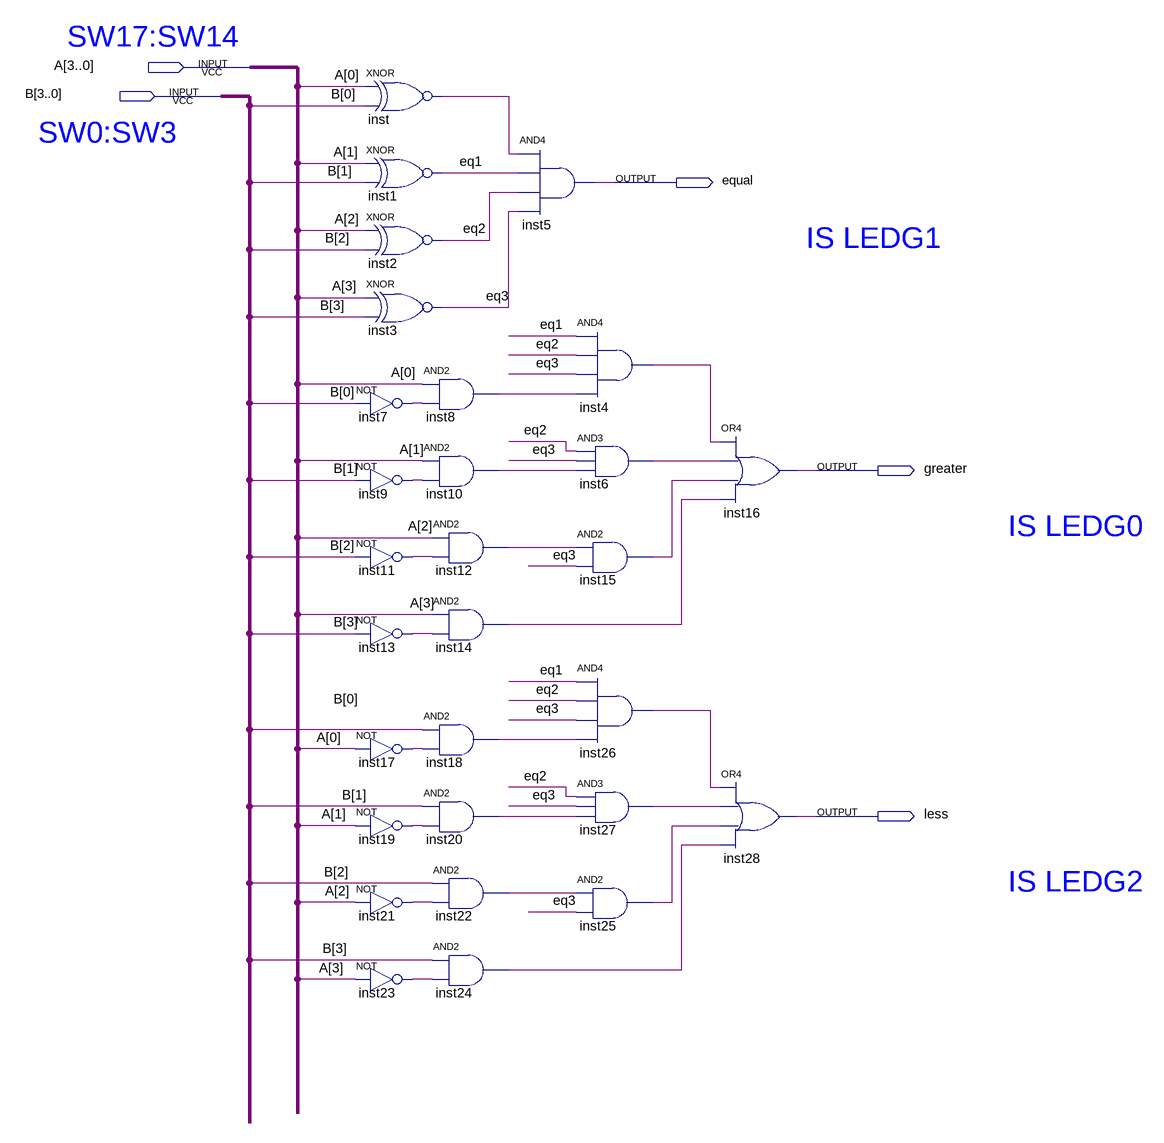
[diagram p0: schematic sheet]
// Quartus schematic Lab1_LogicalComparators.bdf as structural Verilog: 29 symbols, 5 pins
module Lab1_LogicalComparators (
  input  [3:0] A,
  input  [3:0] B,
  output equal,
  output greater,
  output less
);

  wire eq1, eq2, eq3, inst4_out, inst6_out, inst7_out, inst8_out, inst9_out, inst10_out, inst11_out,
       inst12_out, inst13_out, inst14_out, inst15_out, inst17_out, inst18_out, inst19_out, inst20_out,
       inst21_out, inst22_out, inst23_out, inst24_out, inst25_out, inst26_out, inst27_out, inst_out;

  not inst7 (inst7_out, B[0]);
  not inst9 (inst9_out, B[1]);
  not inst11 (inst11_out, B[2]);
  not inst13 (inst13_out, B[3]);
  not inst17 (inst17_out, A[0]);
  not inst19 (inst19_out, A[1]);
  not inst21 (inst21_out, A[2]);
  not inst23 (inst23_out, A[3]);
  xnor inst (inst_out, A[0], B[0]);
  xnor inst1 (eq1, A[1], B[1]);
  xnor inst2 (eq2, A[2], B[2]);
  xnor inst3 (eq3, A[3], B[3]);
  and inst8 (inst8_out, A[0], inst7_out);
  and inst10 (inst10_out, A[1], inst9_out);
  and inst12 (inst12_out, A[2], inst11_out);
  and inst14 (inst14_out, A[3], inst13_out);
  and inst18 (inst18_out, B[0], inst17_out);
  and inst20 (inst20_out, B[1], inst19_out);
  and inst22 (inst22_out, B[2], inst21_out);
  and inst24 (inst24_out, B[3], inst23_out);
  and inst5 (equal, inst_out, eq1, eq2, eq3);
  and inst4 (inst4_out, eq1, eq2, eq3, inst8_out);
  and inst6 (inst6_out, eq2, eq3, inst10_out);
  and inst15 (inst15_out, inst12_out, eq3);
  and inst26 (inst26_out, eq1, eq2, eq3, inst18_out);
  and inst27 (inst27_out, eq2, eq3, inst20_out);
  and inst25 (inst25_out, inst22_out, eq3);
  or inst16 (greater, inst4_out, inst6_out, inst15_out, inst14_out);
  or inst28 (less, inst26_out, inst27_out, inst25_out, inst24_out);

  // Notes on the sheet:
  //   SW17:SW14
  //   SW0:SW3
  //   IS LEDG1
  //   IS LEDG0
  //   IS LEDG2
endmodule
